# EAGLE schematic powerblade_1v0 (EAGLE 6.5.0)

## Sheet 1 of 6: Current & Voltage Measurement
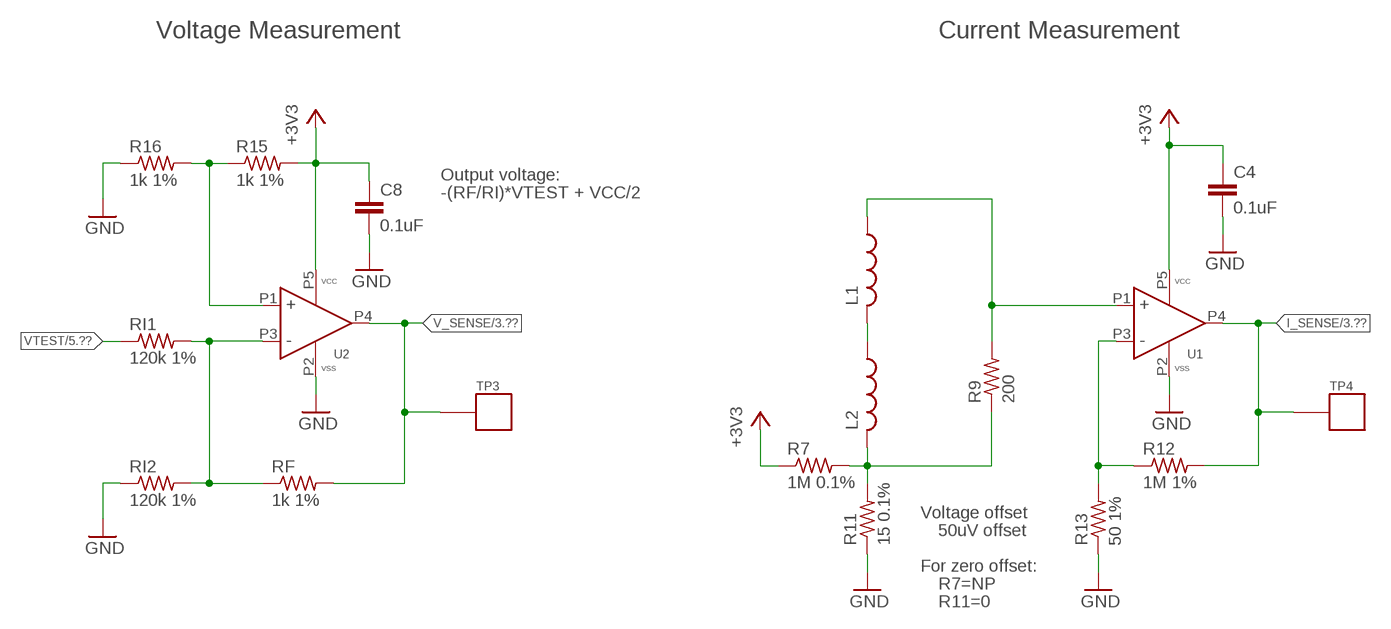
[diagram p0: schematic, sheet 1]

### Parts
C4  0.1uF  C-EUC0402  [C0402]
C8  0.1uF  C-EUC0402  [C0402]
L1  L-USL0805  [L0805]
L2  L-USL0805  [L0805]
R7  1M 0.1%  R-US_R0603  [R0603]
R9  200  R-US_R0603  [R0603]
R11  15 0.1%  R-US_R0603  [R0603]
R12  1M 1%  R-US_R0603  [R0603]
R13  50 1%  R-US_R0603  [R0603]
R15  1k 1%  R-US_R0603  [R0603]
R16  1k 1%  R-US_R0603  [R0603]
RF  1k 1%  R-US_R0603  [R0603]
RI1  120k 1%  R-US_R0603  [R0603]
RI2  120k 1%  R-US_R0603  [R0603]
TP3  TP_STD  [TP]
TP4  TP_STD  [TP]
U1  MAX9910  [SC70-5]
U2  MAX9910  [SC70-5]

### Nets
+3V3: C4.1 C8.1 R7.1 R15.2 U1.P5(VCC) U2.P5(VCC) ; also sheet 2,3,4,5,6
GND: C4.2 C8.2 R11.1 R13.1 R16.1 RI2.1 U1.P2(VSS) U2.P2(VSS) ; also sheet 2,3,4,5,6
I_SENSE: R12.2 TP4.P$1 U1.P4(OUT) ; also sheet 3,4
N$1: R15.1 R16.2 U2.P1(IN+)
N$9: R12.1 R13.2 U1.P3(IN-)
N$10: RF.1 RI1.2 RI2.2 U2.P3(IN-)
N$13: L2.2 R7.2 R9.1 R11.2
N$16: L1.1 R9.2 U1.P1(IN+)
N$25: L1.2 L2.1
V_SENSE: RF.2 TP3.P$1 U2.P4(OUT) ; also sheet 3,4
VTEST: RI1.1 ; also sheet 5

### Notes on the sheet
- Voltage Measurement | Current Measurement
- Output voltage:
- -(RF/RI)*VTEST + VCC/2
- Voltage offset
- 50uV offset
- For zero offset:
- R7=NP
- R11=0

## Sheet 2 of 6: WISP 5.0 Front End
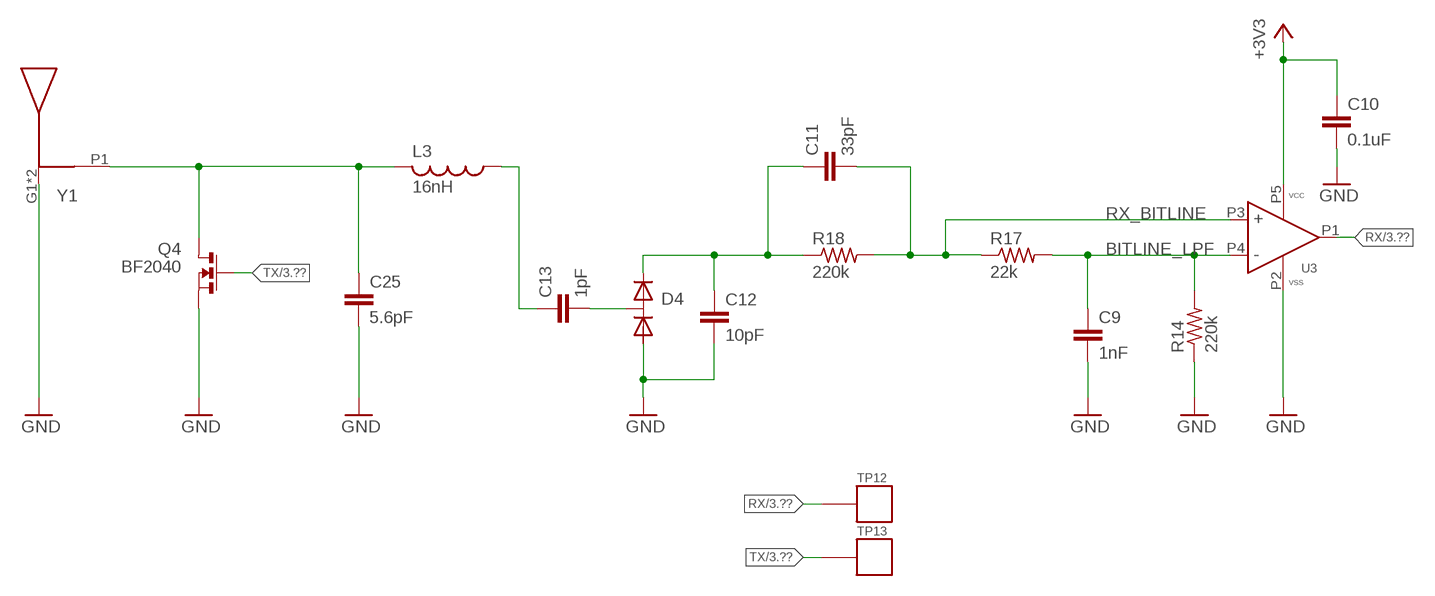
[diagram p1: schematic, sheet 2]

### Parts
C9  1nF  C-EUC0603  [C0603]
C10  0.1uF  C-EUC0603  [C0603]
C11  33pF  C-EUC0603  [C0603]
C12  10pF  C-EUC0603  [C0603]
C13  1pF  C-EUC0603  [C0603]
C25  5.6pF  C-EUC0603  [C0603]
D4  HSMS-285C  [SOT-323]
L3  16nH  L-USL0603  [L0603]
Q4  BF2040  [SOT-143]
R14  220k  R-US_R0603  [R0603]
R17  22k  R-US_R0603  [R0603]
R18  220k  R-US_R0603  [R0603]
TP12  TP_STD  [TP]
TP13  TP_STD  [TP]
U3  NCS2200S  [SC70-5]
Y1  ANT-USP  [ANT-USP]

### Nets
+3V3: C10.1 U3.P5(VCC) ; also sheet 1,3,4,5,6
ANT: C25.1 L3.2 Q4.P2(D) Y1.P1
BITLINE_LPF: C9.1 R14.2 R17.2 U3.P4(IN-)
GND: C9.2 C10.2 C12.2 C25.2 D4.P1 Q4.P1(S) R14.1 U3.P2(VSS) Y1.G1(G) Y1.G2(G) ; also sheet 1,3,4,5,6
N$4: C13.1 L3.1
N$21: C13.2 D4.P3
N$22: C11.1 C12.1 D4.P2 R18.1
RX: TP12.P$1 U3.P1(OUT) ; also sheet 3,4
RX_BITLINE: C11.2 R17.1 R18.2 U3.P3(IN+)
TX: Q4.P3(G) Q4.P4(G) TP13.P$1 ; also sheet 3,4

## Sheet 3 of 6: MSP430
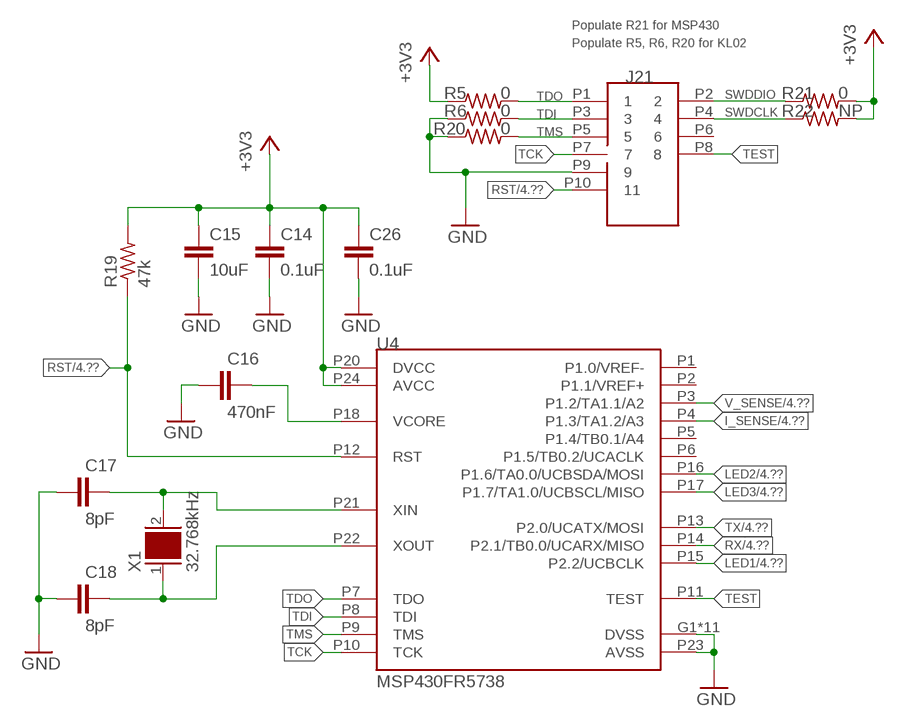
[diagram p2: schematic, sheet 3]

### Parts
C14  0.1uF  C-EUC0603  [C0603]
C15  10uF  C-EUC0603  [C0603]
C16  470nF  C-EUC0603  [C0603]
C17  8pF  C-EUC0603  [C0603]
C18  8pF  C-EUC0603  [C0603]
C26  0.1uF  C-EUC0603  [C0603]
J21  JTAG_14PIN_IDC-NL  [TC2050-IDC-NL-430]
R5  0  R-US_R0603  [R0603]
R6  0  R-US_R0603  [R0603]
R19  47k  R-US_R0603  [R0603]
R20  0  R-US_R0603  [R0603]
R21  0  R-US_R0603  [R0603]
R22  NP  R-US_R0603  [R0603]
U4  MSP430FR5738  [VQFN-24]
X1  32.768kHz  CRYSTAL_0805  [0805]

### Nets
+3V3: C14.1 C15.1 C26.1 R5.1 R19.2 R21.2 R22.2 U4.P20(DVCC) U4.P24(AVCC) ; also sheet 1,2,4,5,6
GND: C14.2 C15.2 C16.1 C17.1 C18.1 C26.2 J21.P9 R6.1 R20.1 U4.G1(DVSS) U4.G2(DVSS) U4.G3(DVSS) U4.G4(DVSS) U4.G5(DVSS) U4.G6(DVSS) U4.G7(DVSS) U4.G8(DVSS) U4.G9(DVSS) U4.P19(DVSS) U4.P23(AVSS) U4.PAD(DVSS) ; also sheet 1,2,4,5,6
I_SENSE: U4.P4(P1.3/TA1.2/A3) ; also sheet 1,4
LED1: U4.P15(P2.2/UCBCLK) ; also sheet 4,6
LED2: U4.P16(P1.6/TA0.0/UCBSDA/MOSI) ; also sheet 4,6
LED3: U4.P17(P1.7/TA1.0/UCBSCL/MISO) ; also sheet 4,6
N$19: C18.2 U4.P22(XOUT) X1.1
N$23: C16.2 U4.P18(VCORE)
N$24: C17.2 U4.P21(XIN) X1.2
RST: J21.P10 R19.1 U4.P12(RST) ; also sheet 4
RX: U4.P14(P2.1/TB0.0/UCARX/MISO) ; also sheet 2,4
SWDCLK: J21.P4 R22.1 ; also sheet 4
SWDDIO: J21.P2 R21.1 ; also sheet 4
TCK: J21.P7 U4.P10(TCK)
TDI: J21.P3 R6.2 U4.P8(TDI)
TDO: J21.P1 R5.2 U4.P7(TDO)
TEST: J21.P8 U4.P11(TEST)
TMS: J21.P5 R20.2 U4.P9(TMS)
TX: U4.P13(P2.0/UCATX/MOSI) ; also sheet 2,4
V_SENSE: U4.P3(P1.2/TA1.1/A2) ; also sheet 1,4
Unconnected: J21.P6 U4.P1(P1.0/VREF-) U4.P2(P1.1/VREF+) U4.P5(P1.4/TB0.1/A4) U4.P6(P1.5/TB0.2/UCACLK)

### Notes on the sheet
- Populate R21 for MSP430
- Populate R5, R6, R20 for KL02

## Sheet 4 of 6: KL02
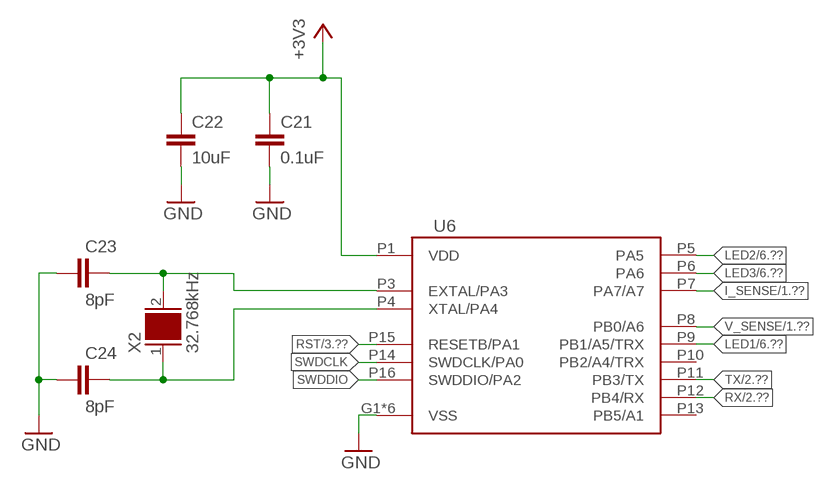
[diagram p3: schematic, sheet 4]

### Parts
C21  0.1uF  C-EUC0603  [C0603]
C22  10uF  C-EUC0603  [C0603]
C23  8pF  C-EUC0603  [C0603]
C24  8pF  C-EUC0603  [C0603]
U6  KL02  [WQFN-16]
X2  32.768kHz  CRYSTAL_0805  [0805]

### Nets
+3V3: C21.1 C22.1 U6.P1(VDD) ; also sheet 1,2,3,5,6
GND: C21.2 C22.2 C23.1 C24.1 U6.G1(VSS) U6.G3(VSS) U6.G7(VSS) U6.G9(VSS) U6.P2(VSS) U6.PAD(VSS) ; also sheet 1,2,3,5,6
I_SENSE: U6.P7(PA7/A7) ; also sheet 1,3
LED1: U6.P9(PB1/A5/TRX) ; also sheet 3,6
LED2: U6.P5(PA5) ; also sheet 3,6
LED3: U6.P6(PA6) ; also sheet 3,6
N$5: C24.2 U6.P4(XTAL/PA4) X2.1
N$6: C23.2 U6.P3(EXTAL/PA3) X2.2
RST: U6.P15(RESETB/PA1) ; also sheet 3
RX: U6.P12(PB4/RX) ; also sheet 2,3
SWDCLK: U6.P14(SWDCLK/PA0) ; also sheet 3
SWDDIO: U6.P16(SWDDIO/PA2) ; also sheet 3
TX: U6.P11(PB3/TX) ; also sheet 2,3
V_SENSE: U6.P8(PB0/A6) ; also sheet 1,3
Unconnected: U6.P10(PB2/A4/TRX) U6.P13(PB5/A1)

## Sheet 5 of 6: AC-DC Power Supply
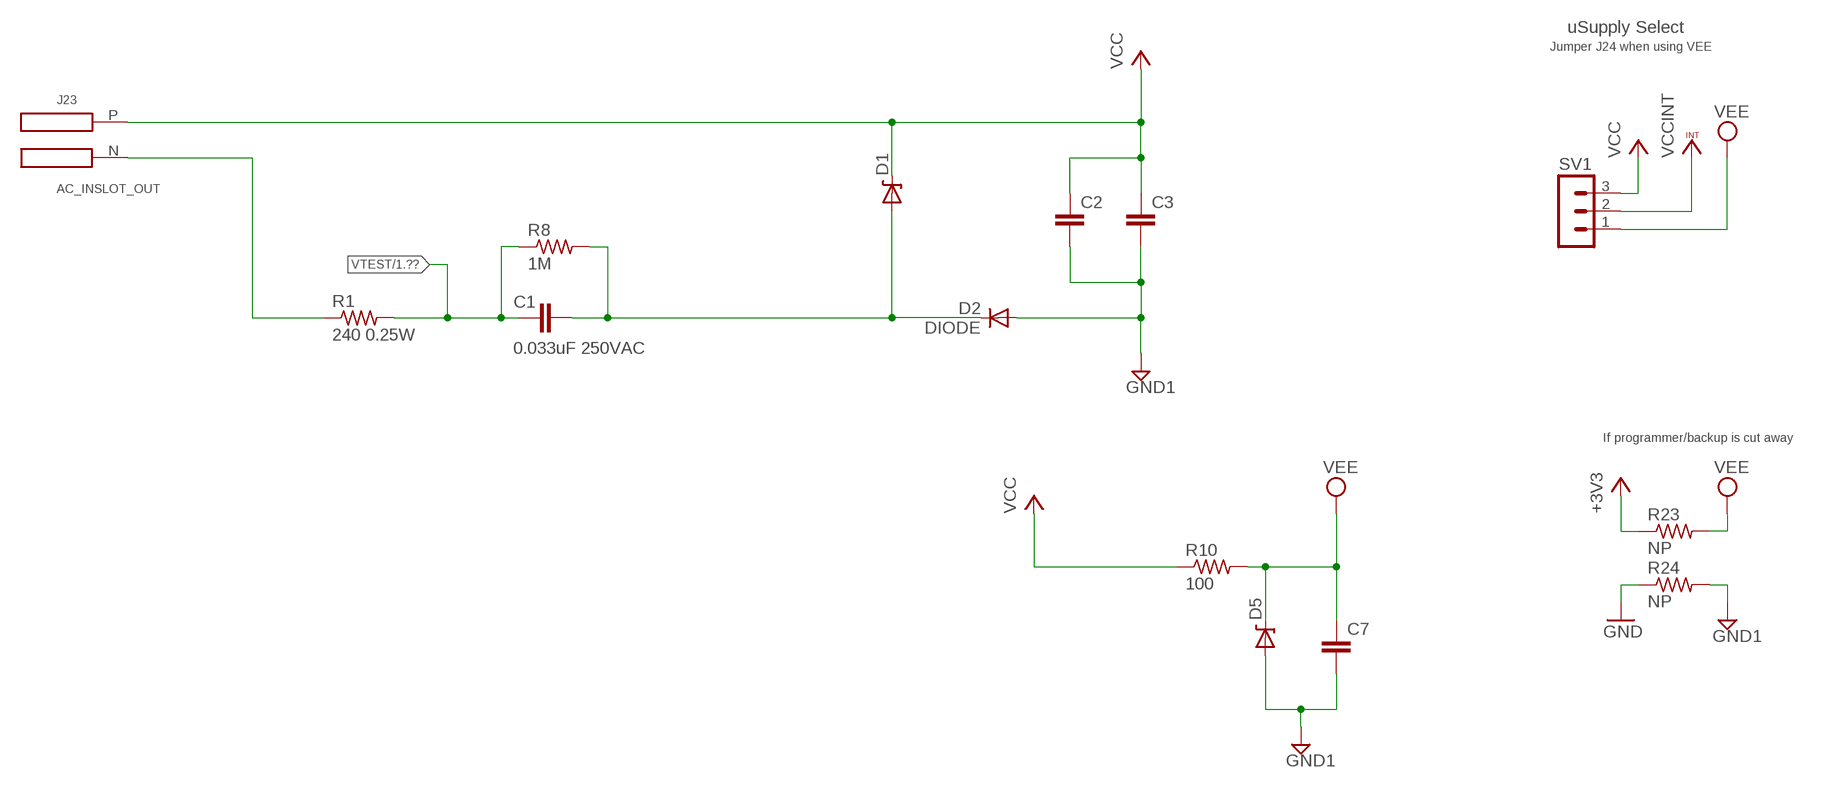
[diagram p4: schematic, sheet 5]

### Parts
C1  0.033uF 250VAC  C-EUC2220K  [C2220K]
C2  C-EUC0805  [C0805]
C3  C-EUC0603  [C0603]
C7  C-EUC0603  [C0603]
D1  ZENERBZT52  [BZT52]
D2  DIODE  [BAS521]
D5  ZENERBZT52  [BZT52]
J23  AC_INSLOT_OUT  [AC_SLOT_OUT]
R1  240 0.25W  R-US_R0603  [R0603]
R8  1M  R-US_R0603  [R0603]
R10  100  R-US_R0603  [R0603]
R23  NP  R-US_R0603  [R0603]
R24  NP  R-US_R0603  [R0603]
SV1  MA03-1STR  [MA03-1]

### Nets
+3V3: R23.1 ; also sheet 1,2,3,4,6
GND: R24.1 ; also sheet 1,2,3,4,6
GND1: C2.2 C3.2 C7.2 D2.A D5.A R24.2 ; also sheet 6
N$2: J23.N R1.1
N$3: C1.1 D1.A D2.C R8.2
VCC: C2.1 C3.1 D1.C J23.P R10.1 SV1.3
VCCINT: SV1.2 ; also sheet 6
VEE: C7.1 D5.C R10.2 R23.2 SV1.1
VTEST: C1.2 R1.2 R8.1 ; also sheet 1

### Notes on the sheet
- uSupply Select
- Jumper J24 when using VEE
- If programmer/backup is cut away

## Sheet 6 of 6: Other Power
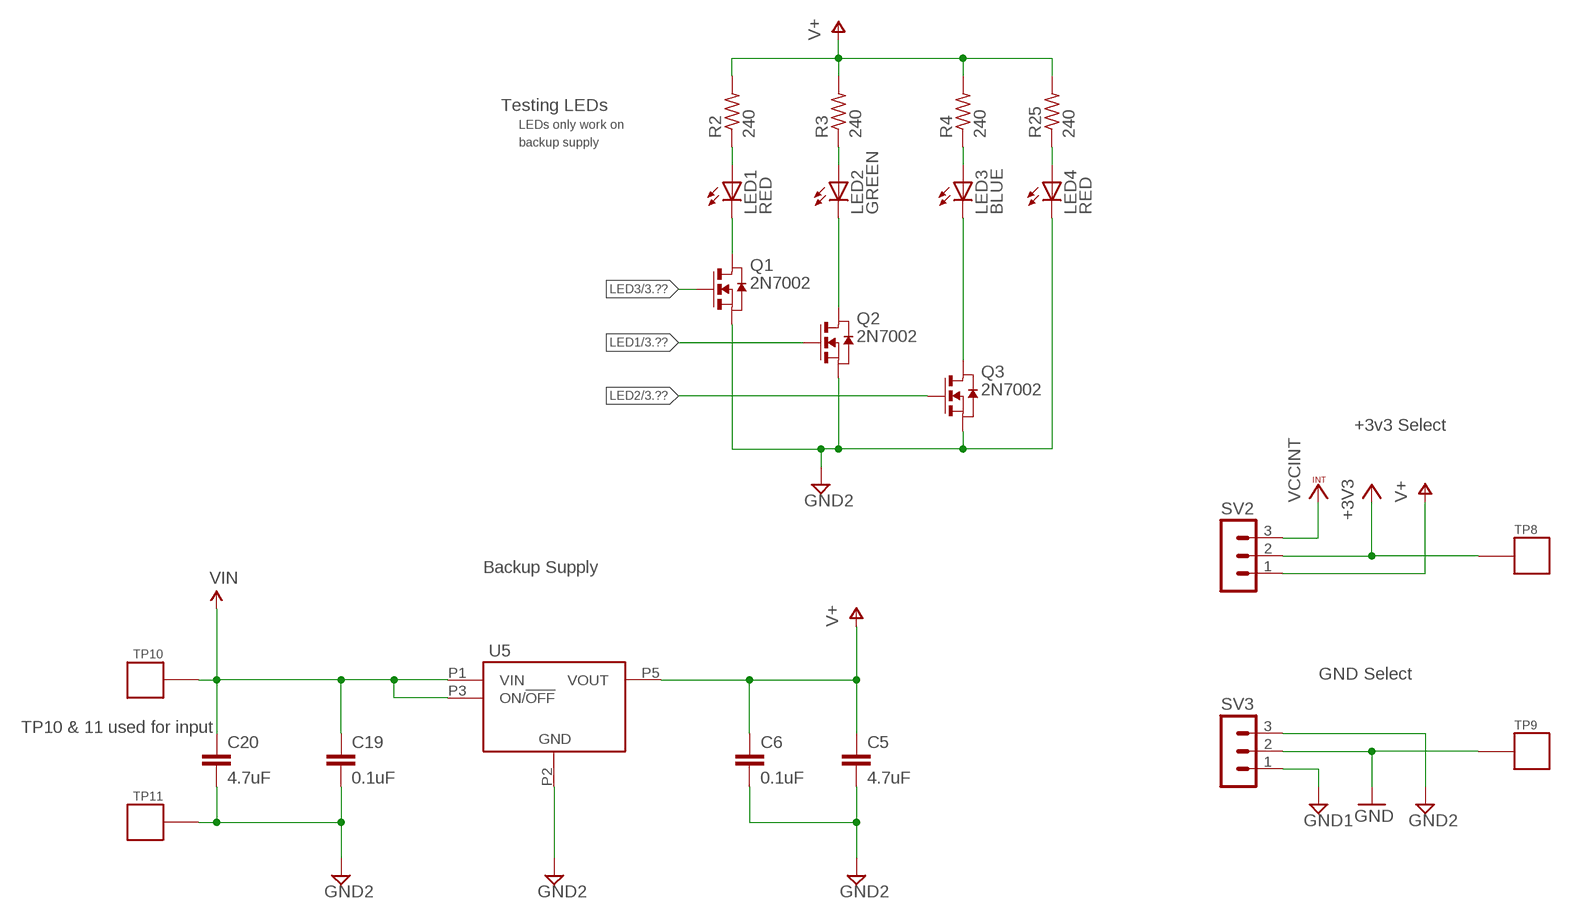
[diagram p5: schematic, sheet 6]

### Parts
C5  4.7uF  C-EUC0603  [C0603]
C6  0.1uF  C-EUC0603  [C0603]
C19  0.1uF  C-EUC0603  [C0603]
C20  4.7uF  C-EUC0603  [C0603]
LED1  RED  LED0603  [LED-0603]
LED2  GREEN  LED0603  [LED-0603]
LED3  BLUE  LED0603  [LED-0603]
LED4  RED  LED0603  [LED-0603]
Q1  2N7002  [SC-70-3]
Q2  2N7002  [SC-70-3]
Q3  2N7002  [SC-70-3]
R2  240  R-US_R0603  [R0603]
R3  240  R-US_R0603  [R0603]
R4  240  R-US_R0603  [R0603]
R25  240  R-US_R0603  [R0603]
SV2  MA03-1STR  [MA03-1]
SV3  MA03-1STR  [MA03-1]
TP8  TP_STD  [TP]
TP9  TP_STD  [TP]
TP10  TP_STD  [TP]
TP11  TP_STD  [TP]
U5  LP2980  [SOT-23-5]

### Nets
+3V3: SV2.2 TP8.P$1 ; also sheet 1,2,3,4,5
GND: SV3.2 TP9.P$1 ; also sheet 1,2,3,4,5
GND1: SV3.1 ; also sheet 5
GND2: C5.2 C6.2 C19.2 C20.2 LED4.C Q1.P2(S) Q2.P2(S) Q3.P2(S) SV3.3 TP11.P$1 U5.P2(GND)
LED1: Q2.P1(G) ; also sheet 3,4
LED2: Q3.P1(G) ; also sheet 3,4
LED3: Q1.P1(G) ; also sheet 3,4
N$7: LED1.A R2.1
N$8: LED1.C Q1.P3(D)
N$11: LED2.C Q2.P3(D)
N$12: LED2.A R3.1
N$14: LED3.A R4.1
N$15: LED3.C Q3.P3(D)
N$17: LED4.A R25.1
V+: C5.1 C6.1 R2.2 R3.2 R4.2 R25.2 SV2.1 U5.P5(VOUT)
VCCINT: SV2.3 ; also sheet 5
VIN: C19.1 C20.1 TP10.P$1 U5.P1(VIN) U5.P3(ON/!OFF!)

### Notes on the sheet
- Testing LEDs
- LEDs only work on
- backup supply
- +3v3 Select
- Backup Supply
- GND Select
- TP10 & 11 used for input

## Library data of the parts
C1 = rcl:C-EU: CAPACITOR, European symbol; DIGIKEY: 490-4238-1-ND
C2 = rcl:C-EU: CAPACITOR, European symbol; DIGIKEY: 445-8238-1-ND
C3 = rcl:C-EU: CAPACITOR, European symbol; DIGIKEY: 445-9077-1-ND
C4 C8 = rcl:C-EU: CAPACITOR, European symbol; DIGIKEY: 445-1265-1-ND
C5 C20 = rcl:C-EU: CAPACITOR, European symbol; DIGIKEY: 490-3302-1-ND
C6 C10 C14 C19 C21 C26 = rcl:C-EU: CAPACITOR, European symbol; DIGIKEY: 445-1316-1-ND
C7 = rcl:C-EU: CAPACITOR, European symbol; DIGIKEY: 1276-2383-1-ND
C9 = rcl:C-EU: CAPACITOR, European symbol; DIGIKEY: 490-6377-1-ND
C11 = rcl:C-EU: CAPACITOR, European symbol; DIGIKEY: 399-7894-1-ND
C12 = rcl:C-EU: CAPACITOR, European symbol; DIGIKEY: 1276-2151-1-ND
C13 = rcl:C-EU: CAPACITOR, European symbol; DIGIKEY: 712-1323-1-ND
C15 C22 = rcl:C-EU: CAPACITOR, European symbol; DIGIKEY: 1276-1119-1-ND
C16 = rcl:C-EU: CAPACITOR, European symbol; DIGIKEY: 445-5192-1-ND
C17 C18 C23 C24 = rcl:C-EU: CAPACITOR, European symbol; DIGIKEY: 1276-1817-1-ND
C25 = rcl:C-EU: CAPACITOR, European symbol; DIGIKEY: 712-1360-1-ND
D1 = powerfilm:ZENER; DIGIKEY: BZT52C3V3T-7DICT-ND; DIGIKEY_2: BZT585B5V1T-7DICT-ND; DIGIKEY_3: BZT585B6V8T-7DICT-ND
D2 = powerfilm:DIODE; DIGIKEY: BAS521-7DICT-ND
D4 = powerfilm:HSMS-285C; DIGIKEY: 516-2558-ND
D5 = powerfilm:ZENER; DIGIKEY: BZT52C3V3T-7DICT-ND
J21 = ibat:JTAG_14PIN; DIGIKEY: NP; TAG-CONNECT: TC2050-IDC-NL-430
J23 = powerfilm:AC_IN; DIGIKEY: 3M11307-ND
L1 L2 = rcl:L-US: INDUCTOR, American symbol
L3 = rcl:L-US: INDUCTOR, American symbol; DIGIKEY: 732-1728-1-ND; DIGIKEY_2: A103728CT-ND
LED1 LED4 = SparkFun-LED:LED: LEDs Standard schematic elements and footprints for 5mm, 3mm, 1206, and 0603 sized LEDs. 5mm - Spark Fun Electronics SKU : COM-00529 (and others); DIGIKEY: 1080-1400-1-ND
LED2 = SparkFun-LED:LED: LEDs Standard schematic elements and footprints for 5mm, 3mm, 1206, and 0603 sized LEDs. 5mm - Spark Fun Electronics SKU : COM-00529 (and others); DIGIKEY: 1080-1402-1-ND
LED3 = SparkFun-LED:LED: LEDs Standard schematic elements and footprints for 5mm, 3mm, 1206, and 0603 sized LEDs. 5mm - Spark Fun Electronics SKU : COM-00529 (and others); DIGIKEY: 1080-1401-1-ND
Q1-Q3 = nav:2N7002; DIGIKEY: 2N7002WCT-ND
Q4 = powerfilm:BF2040; DIGIKEY: BF 2040 E6814CT-ND
R1 = rcl:R-US_: RESISTOR, American symbol; DIGIKEY: RHM240DCT-ND
R2-R4 R25 = rcl:R-US_: RESISTOR, American symbol; DIGIKEY: P240GCT-ND
R5 R6 R20 R21 = rcl:R-US_: RESISTOR, American symbol; DIGIKEY: P0.0GCT-ND
R7 R12 = rcl:R-US_: RESISTOR, American symbol; DIGIKEY: A102234CT-ND
R8 = rcl:R-US_: RESISTOR, American symbol; DIGIKEY: MCT0603-1.00M-CFCT-ND
R9 = rcl:R-US_: RESISTOR, American symbol; DIGIKEY: P200HCT-ND
R10 = rcl:R-US_: RESISTOR, American symbol; DIGIKEY: P100GCT-ND
R11 = rcl:R-US_: RESISTOR, American symbol; DIGIKEY: A109933CT-ND
R13 = rcl:R-US_: RESISTOR, American symbol; DIGIKEY: P49.9HCT-ND
R14 R18 = rcl:R-US_: RESISTOR, American symbol; DIGIKEY: P220KDBCT-ND
R15 R16 RF = rcl:R-US_: RESISTOR, American symbol; DIGIKEY: P1.00KHCT-ND
R17 = rcl:R-US_: RESISTOR, American symbol; DIGIKEY: P22KDBCT-ND
R19 = rcl:R-US_: RESISTOR, American symbol; DIGIKEY: P47KGCT-ND
R22-R24 = rcl:R-US_: RESISTOR, American symbol; DIGIKEY: NP
RI1 RI2 = rcl:R-US_: RESISTOR, American symbol; DIGIKEY: P120KHCT-ND
SV1-SV3 = con-lstb:MA03-1: PIN HEADER; DIGIKEY: 3M9448-ND; OC_FARNELL: unknown; OC_NEWARK: unknown
TP3 TP4 TP8-TP13 = skyspecs:TP
U1 U2 = powerfilm:MAX9910; DIGIKEY: MAX9910EXK+TCT-ND
U3 = powerfilm:NCS2200S; DIGIKEY: NCS2200SQ2T2GOSCT-ND
U4 = powerfilm:MSP430FR5738; DIGIKEY: 296-29232-1-ND
U5 = powerfilm:LP2980; DIGIKEY: LP2980AIM5X-3.3/NOPBCT-ND
U6 = powerfilm:KL02; DIGIKEY: MKL02Z8VFG4-ND
X1 X2 = general:CRYSTAL_0805; DIGIKEY: 535-12373-1-ND
Y1 = powerfilm:ANT-USP; DIGIKEY: ANT-916-USP-ND; DIGIKEY_2: 732-1835-1-ND